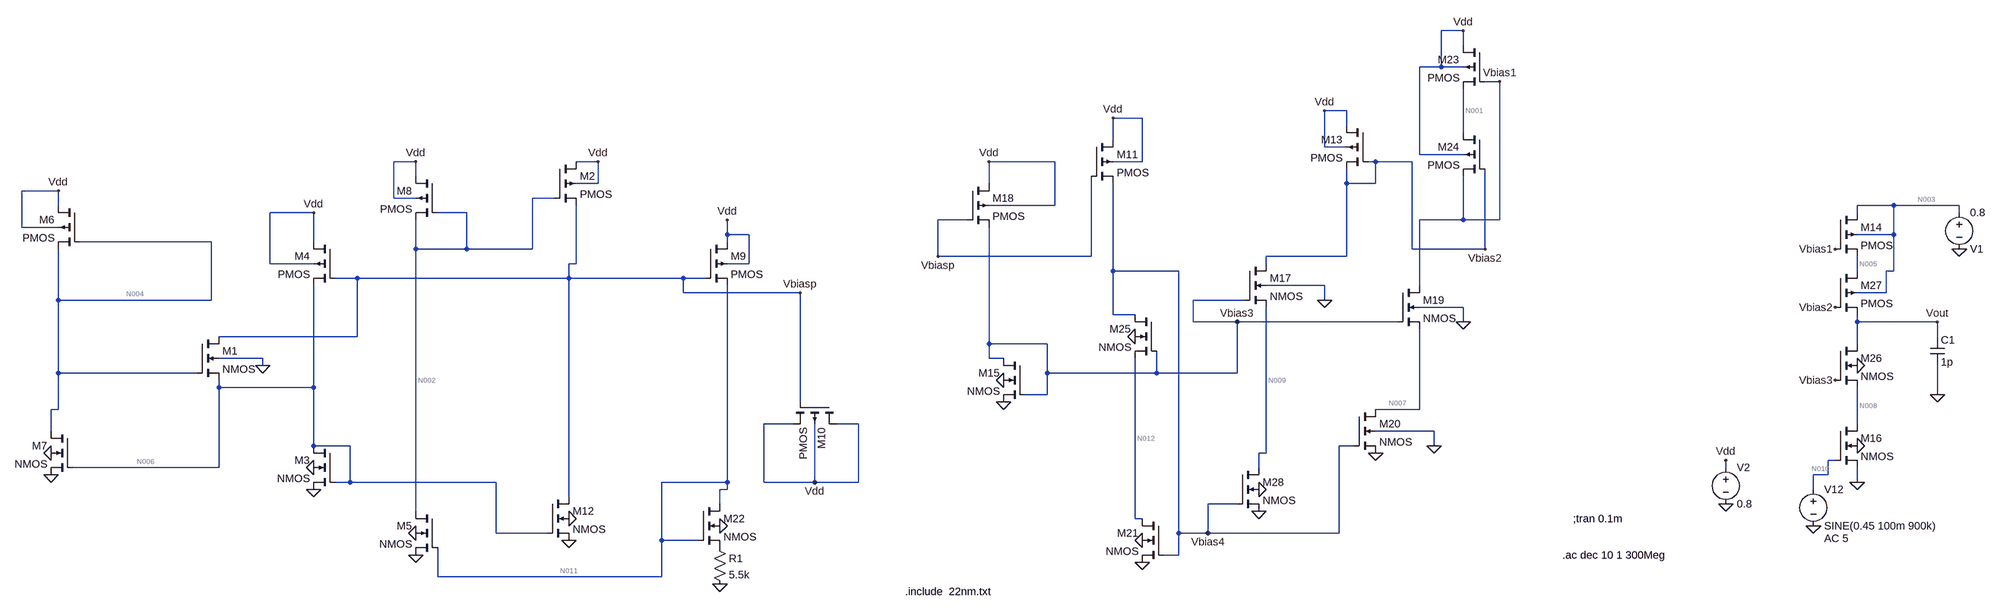
[diagram p0: schematic LTSPICE_22nm.asc]
LTSPICE_22nm.asc, the LTspice schematic file:
Version 4
SHEET 1 6952 1828
WIRE 3568 288 3520 288
WIRE 3568 320 3568 288
WIRE 3520 368 3520 288
WIRE 3520 368 3472 368
WIRE 3568 368 3520 368
WIRE 3648 400 3616 400
WIRE 3312 464 3264 464
WIRE 2864 480 2800 480
WIRE 3312 496 3312 464
WIRE 3568 512 3568 416
WIRE 2800 528 2800 480
WIRE 3264 544 3264 464
WIRE 3312 544 3264 544
WIRE 3472 560 3472 368
WIRE 3568 560 3472 560
WIRE 1104 576 1056 576
WIRE 1504 576 1456 576
WIRE 2672 576 2528 576
WIRE 2864 576 2864 480
WIRE 2864 576 2800 576
WIRE 3376 576 3360 576
WIRE 3456 576 3376 576
WIRE 1104 608 1104 576
WIRE 1504 624 1504 576
WIRE 1504 624 1456 624
WIRE 2528 624 2528 576
WIRE 3312 624 3312 592
WIRE 3376 624 3376 576
WIRE 3376 624 3312 624
WIRE 320 640 240 640
WIRE 1056 656 1056 576
WIRE 1104 656 1056 656
WIRE 1408 656 1360 656
WIRE 320 672 320 640
WIRE 2672 672 2672 576
WIRE 2672 672 2528 672
WIRE 4832 672 4752 672
WIRE 4976 672 4832 672
WIRE 880 688 784 688
WIRE 1216 688 1152 688
WIRE 4752 688 4752 672
WIRE 4976 688 4976 672
WIRE 2480 704 2416 704
WIRE 3568 704 3568 608
WIRE 3568 704 3472 704
WIRE 3648 704 3648 400
WIRE 3648 704 3568 704
WIRE 240 720 240 640
WIRE 320 720 240 720
WIRE 1872 736 1872 704
WIRE 1920 736 1872 736
WIRE 4832 736 4832 672
WIRE 4832 736 4752 736
WIRE 656 752 368 752
WIRE 880 752 880 688
WIRE 1872 752 1872 736
WIRE 1104 768 1104 704
WIRE 1216 768 1216 688
WIRE 1216 768 1104 768
WIRE 1360 768 1360 656
WIRE 1360 768 1216 768
WIRE 3456 768 3456 576
WIRE 3616 768 3616 592
WIRE 3616 768 3456 768
WIRE 2416 784 2416 704
WIRE 2752 784 2752 608
WIRE 2752 784 2416 784
WIRE 3312 784 3312 624
WIRE 3312 784 3136 784
WIRE 784 800 784 688
WIRE 880 800 784 800
WIRE 1456 800 1456 672
WIRE 1456 800 1440 800
WIRE 1920 800 1920 736
WIRE 1920 800 1872 800
WIRE 3136 800 3136 784
WIRE 2800 816 2800 624
WIRE 2944 816 2800 816
WIRE 4752 816 4752 784
WIRE 4832 816 4832 736
WIRE 4832 816 4816 816
WIRE 976 832 928 832
WIRE 1440 832 1440 800
WIRE 1440 832 976 832
WIRE 1776 832 1440 832
WIRE 1824 832 1776 832
WIRE 3264 848 3136 848
WIRE 3472 848 3472 704
WIRE 1776 864 1776 832
WIRE 2032 864 1776 864
WIRE 4816 864 4816 816
WIRE 4816 864 4752 864
WIRE 320 880 320 768
WIRE 656 880 656 752
WIRE 656 880 320 880
WIRE 3088 880 2976 880
WIRE 3264 880 3264 848
WIRE 3568 896 3472 896
WIRE 2800 912 2800 816
WIRE 2848 912 2800 912
WIRE 2976 928 2976 880
WIRE 3072 928 2976 928
WIRE 3424 928 3072 928
WIRE 3568 928 3568 896
WIRE 4752 928 4752 912
WIRE 4928 928 4752 928
WIRE 976 960 976 832
WIRE 976 960 672 960
WIRE 4928 960 4928 928
WIRE 2528 976 2528 720
WIRE 2656 976 2528 976
WIRE 4752 976 4752 928
WIRE 768 1008 672 1008
WIRE 2528 1008 2528 976
WIRE 2560 1008 2528 1008
WIRE 768 1024 768 1008
WIRE 320 1040 320 880
WIRE 624 1040 320 1040
WIRE 2656 1040 2656 976
WIRE 2896 1040 2896 992
WIRE 2896 1040 2656 1040
WIRE 3072 1040 3072 928
WIRE 3072 1040 2896 1040
WIRE 672 1072 672 1056
WIRE 880 1072 880 848
WIRE 880 1072 672 1072
WIRE 2656 1088 2656 1040
WIRE 2656 1088 2608 1088
WIRE 4928 1088 4928 1024
WIRE 2032 1104 2032 864
WIRE 320 1120 320 1040
WIRE 320 1120 304 1120
WIRE 3472 1120 3472 944
WIRE 3472 1120 3376 1120
WIRE 2016 1152 1952 1152
WIRE 2160 1152 2112 1152
WIRE 4752 1152 4752 1072
WIRE 304 1168 304 1120
WIRE 3504 1168 3376 1168
WIRE 880 1200 880 1072
WIRE 960 1200 880 1200
WIRE 3328 1200 3296 1200
WIRE 3504 1200 3504 1168
WIRE 3136 1216 3136 896
WIRE 3136 1216 3120 1216
WIRE 4704 1232 4688 1232
WIRE 672 1248 672 1072
WIRE 672 1248 352 1248
WIRE 3120 1248 3120 1216
WIRE 4464 1248 4464 1232
WIRE 4688 1264 4688 1232
WIRE 4688 1264 4656 1264
WIRE 960 1280 960 1200
WIRE 960 1280 928 1280
WIRE 1280 1280 960 1280
WIRE 1872 1280 1872 848
WIRE 1872 1280 1728 1280
WIRE 1952 1280 1952 1152
WIRE 2064 1280 2064 1152
WIRE 2064 1280 1952 1280
WIRE 2160 1280 2160 1152
WIRE 2160 1280 2064 1280
WIRE 4752 1280 4752 1248
WIRE 1872 1296 1872 1280
WIRE 1872 1296 1856 1296
WIRE 4656 1296 4656 1264
WIRE 1440 1312 1440 832
WIRE 1856 1328 1856 1296
WIRE 3072 1328 3008 1328
WIRE 1104 1344 1104 768
WIRE 2848 1360 2848 1008
WIRE 2864 1360 2848 1360
WIRE 1280 1392 1280 1280
WIRE 1392 1392 1280 1392
WIRE 2944 1392 2944 816
WIRE 3008 1392 3008 1328
WIRE 3008 1392 2944 1392
WIRE 3296 1392 3296 1200
WIRE 3296 1392 3008 1392
WIRE 1728 1408 1728 1280
WIRE 1808 1408 1728 1408
WIRE 2944 1440 2944 1392
WIRE 2944 1440 2912 1440
WIRE 1152 1488 1152 1424
WIRE 1728 1488 1728 1408
WIRE 1728 1488 1152 1488
FLAG 304 1264 0
FLAG 880 1296 0
FLAG 1104 1440 0
FLAG 1440 1408 0
FLAG 304 1216 0
FLAG 880 1248 0
FLAG 1104 1392 0
FLAG 1440 1360 0
FLAG 1856 1376 0
FLAG 1856 1504 0
FLAG 2864 1456 0
FLAG 3120 1344 0
FLAG 2864 1408 0
FLAG 3120 1296 0
FLAG 2560 1104 0
FLAG 2560 1056 0
FLAG 2848 960 0
FLAG 3264 880 0
FLAG 3376 1216 0
FLAG 4928 1088 0
FLAG 4976 768 0
FLAG 4656 1376 0
FLAG 4752 1280 0
FLAG 4928 928 Vout
FLAG 4752 1200 0
FLAG 4752 1024 0
FLAG 2032 864 Vbiasp
FLAG 2416 784 Vbiasp
FLAG 3072 928 Vbias3
FLAG 3008 1392 Vbias4
FLAG 3648 400 Vbias1
FLAG 3616 768 Vbias2
FLAG 4704 768 Vbias1
FLAG 4704 896 Vbias2
FLAG 4704 1056 Vbias3
FLAG 4464 1328 0
FLAG 4464 1232 Vdd
FLAG 320 640 Vdd
FLAG 880 688 Vdd
FLAG 1104 576 Vdd
FLAG 1504 576 Vdd
FLAG 2064 1280 Vdd
FLAG 1872 704 Vdd
FLAG 2528 576 Vdd
FLAG 2800 480 Vdd
FLAG 3264 464 Vdd
FLAG 3568 288 Vdd
FLAG 768 1024 0
FLAG 3568 928 0
FLAG 3504 1200 0
SYMBOL pmos4 368 672 M0
SYMATTR InstName M6
SYMATTR Value2 l=440n w=220n
SYMBOL pmos4 928 752 M0
SYMATTR InstName M4
SYMATTR Value2 l=44n w=528n
SYMBOL pmos4 1152 608 M0
SYMATTR InstName M8
SYMATTR Value2 l=44n w=528n
SYMBOL pmos4 1408 576 R0
SYMATTR InstName M2
SYMATTR Value2 l=44n w=528n
SYMBOL pmos4 1824 752 R0
SYMATTR InstName M9
SYMATTR Value2 l=44n w=528n
SYMBOL nmos4 624 960 R0
SYMATTR InstName M1
SYMATTR Value2 l=44n w=88n
SYMBOL nmos4 352 1168 M0
SYMATTR InstName M7
SYMATTR Value2 l=44n w=220n
SYMBOL nmos4 928 1200 M0
SYMATTR InstName M3
SYMATTR Value2 l=44n w=220n
SYMBOL nmos4 1152 1344 M0
SYMATTR InstName M5
SYMATTR Value2 l=44n w=220n
SYMBOL nmos4 1392 1312 R0
SYMATTR InstName M12
SYMATTR Value2 l=44n w=220n
SYMBOL nmos4 1808 1328 R0
SYMATTR InstName M22
SYMATTR Value2 l=44n w=660n
SYMBOL pmos4 2112 1104 R90
SYMATTR InstName M10
SYMATTR Value2 l=1100n w=1100n
SYMBOL res 1840 1408 R0
SYMATTR InstName R1
SYMATTR Value 5.5k
SYMBOL nmos4 2912 1360 M0
SYMATTR InstName M21
SYMATTR Value2 l=22n w=110n
SYMBOL nmos4 3072 1248 R0
SYMATTR InstName M28
SYMATTR Value2 l=22n w=110n
SYMBOL nmos4 2608 1008 M0
SYMATTR InstName M15
SYMATTR Value2 l=22n w=55n
SYMBOL nmos4 2896 912 M0
SYMATTR InstName M25
SYMATTR Value2 l=22n w=110n
SYMBOL nmos4 3088 800 R0
SYMATTR InstName M17
SYMATTR Value2 l=22n w=110n
SYMBOL nmos4 3328 1120 R0
SYMATTR InstName M20
SYMATTR Value2 l=22n w=110n
SYMBOL nmos4 3424 848 R0
SYMATTR InstName M19
SYMATTR Value2 l=22n w=110n
SYMBOL pmos4 2480 624 R0
SYMATTR InstName M18
SYMATTR Value2 l=22n w=264n
SYMBOL pmos4 3360 496 M0
SYMATTR InstName M13
SYMATTR Value2 l=22n w=88n
SYMBOL pmos4 2752 528 R0
SYMATTR InstName M11
SYMATTR Value2 l=22n w=264n
SYMBOL pmos4 3616 320 M0
SYMATTR InstName M23
SYMATTR Value2 l=22n w=264n
SYMBOL pmos4 3616 512 M0
SYMATTR InstName M24
SYMATTR Value2 l=22n w=264n
SYMBOL voltage 4976 672 R0
WINDOW 0 24 96 Left 2
WINDOW 3 24 16 Left 2
WINDOW 123 0 0 Left 0
WINDOW 39 0 0 Left 0
SYMATTR InstName V1
SYMATTR Value 0.8
SYMBOL voltage 4656 1280 R0
WINDOW 123 24 124 Left 2
WINDOW 39 0 0 Left 0
SYMATTR Value2 AC 5
SYMATTR InstName V12
SYMATTR Value SINE(0.45 100m 900k)
SYMBOL cap 4912 960 R0
SYMATTR InstName C1
SYMATTR Value 1p
SYMBOL nmos4 4704 1152 R0
SYMATTR InstName M16
SYMATTR Value2 l=22n w=359.39n
SYMBOL nmos4 4704 976 R0
SYMATTR InstName M26
SYMATTR Value2 l=22n w=359.39n
SYMBOL pmos4 4704 816 R0
SYMATTR InstName M27
SYMATTR Value2 l=22n w=718.79n
SYMBOL pmos4 4704 688 R0
SYMATTR InstName M14
SYMATTR Value2 l=22n w=718.79n
SYMBOL voltage 4464 1232 R0
WINDOW 123 0 0 Left 0
WINDOW 39 0 0 Left 0
SYMATTR InstName V2
SYMATTR Value 0.8
TEXT 4032 1440 Left 2 !.ac dec 10 1 300Meg
TEXT 4056 1360 Left 2 !;tran 0.1m
TEXT 2344 1520 Left 2 !.include  22nm.txt

The netlist it stands for:
* LTSPICE_22nm.asc
M6 Vdd N004 N004 Vdd PMOS l=440n w=220n
M4 Vdd Vbiasp N006 Vdd PMOS l=44n w=528n
M8 Vdd N002 N002 Vdd PMOS l=44n w=528n
M2 Vdd N002 Vbiasp Vdd PMOS l=44n w=528n
M9 Vdd Vbiasp N011 Vdd PMOS l=44n w=528n
M1 Vbiasp N004 N006 0 NMOS l=44n w=88n
M7 N004 N006 0 0 NMOS l=44n w=220n
M3 N006 N006 0 0 NMOS l=44n w=220n
M5 N002 N011 0 0 NMOS l=44n w=220n
M12 Vbiasp N006 0 0 NMOS l=44n w=220n
M22 N011 N011 P001 0 NMOS l=44n w=660n
M10 Vdd Vbiasp Vdd Vdd PMOS l=1100n w=1100n
R1 P001 0 5.5k
M21 N012 Vbias4 0 0 NMOS l=22n w=110n
M28 N009 Vbias4 0 0 NMOS l=22n w=110n
M15 Vbias3 Vbias3 0 0 NMOS l=22n w=55n
M25 Vbias4 Vbias3 N012 0 NMOS l=22n w=110n
M17 Vbias2 Vbias3 N009 0 NMOS l=22n w=110n
M20 N007 Vbias4 0 0 NMOS l=22n w=110n
M19 Vbias1 Vbias3 N007 0 NMOS l=22n w=110n
M18 Vdd Vbiasp Vbias3 Vdd PMOS l=22n w=264n
M13 Vdd Vbias2 Vbias2 Vdd PMOS l=22n w=88n
M11 Vdd Vbiasp Vbias4 Vdd PMOS l=22n w=264n
M23 Vdd Vbias1 N001 Vdd PMOS l=22n w=264n
M24 N001 Vbias2 Vbias1 Vdd PMOS l=22n w=264n
V1 N003 0 0.8
V12 N010 0 SINE(0.45 100m 900k) AC 5
C1 Vout 0 1p
M16 N008 N010 0 0 NMOS l=22n w=359.39n
M26 Vout Vbias3 N008 0 NMOS l=22n w=359.39n
M27 N005 Vbias2 Vout N003 PMOS l=22n w=718.79n
M14 N003 Vbias1 N005 N003 PMOS l=22n w=718.79n
V2 Vdd 0 0.8
.model NMOS NMOS
.model PMOS PMOS
.lib standard.mos
.ac dec 10 1 300Meg
;tran 0.1m
.include  22nm.txt
.backanno
.end

* Results of the author's LTspice run, read from the files saved beside the schematic
* Operating Point, zero values left out:
*   V(vdd) = 800 mV
*   V(n004) = 14.67 mV
*   V(vbiasp) = 248.5 mV
*   V(n006) = 539.9 mV
*   V(n002) = 265.7 mV
*   V(n011) = 538.9 mV
*   V(p001) = 52.71 mV
*   V(n012) = 103.2 mV
*   V(vbias4) = 632.7 mV
*   V(n009) = 65.09 mV
*   V(vbias3) = 604.5 mV
*   V(vbias2) = 274.5 mV
*   V(n007) = 61.79 mV
*   V(vbias1) = 243.1 mV
*   V(n001) = 706.3 mV
*   V(n003) = 800 mV
*   V(n010) = 450 mV
*   V(vout) = 661.4 mV
*   V(n008) = 189.5 mV
*   V(n005) = 760.2 mV
*   Id(M6) = 2.042 µA
*   Ig(M6) = -58.17 pA
*   Ib(M6) = 58.88 pA
*   Is(M6) = -2.042 µA
*   Id(M4) = 9.579 µA
*   Is(M4) = -9.579 µA
*   Id(M8) = 8.519 µA
*   Is(M8) = -8.519 µA
*   Id(M2) = 8.586 µA
*   Is(M2) = -8.586 µA
*   Id(M9) = 9.584 µA
*   Is(M9) = -9.584 µA
*   Ig(M10) = -10.79 pA
*   Ib(M10) = 10.68 pA
*   Id(M18) = 32.77 µA
*   Is(M18) = -32.77 µA
*   Id(M13) = 20.21 µA
*   Is(M13) = -20.21 µA
*   Id(M11) = 29.23 µA
*   Is(M11) = -29.23 µA
*   Id(M23) = 19.33 µA
*   Is(M23) = -19.33 µA
*   Id(M24) = 19.33 µA
*   Is(M24) = -19.33 µA
*   Id(M27) = 24.84 µA
*   Is(M27) = -24.84 µA
*   Id(M14) = 24.84 µA
*   Is(M14) = -24.84 µA
*   Id(M1) = 1.07 pA
*   Ig(M1) = -6.519 pA
*   Is(M1) = 6.247 pA
*   Id(M7) = 2.042 µA
*   Ig(M7) = 18.24 pA
*   Is(M7) = -2.042 µA
*   Id(M3) = 9.579 µA
*   Ig(M3) = 13.67 pA
*   Is(M3) = -9.579 µA
*   Id(M5) = 8.519 µA
*   Ig(M5) = 13.84 pA
*   Is(M5) = -8.519 µA
*   Id(M12) = 8.586 µA
*   Ig(M12) = 14.18 pA
*   Is(M12) = -8.586 µA
*   Id(M22) = 9.584 µA
*   Ig(M22) = 16.33 pA
*   Is(M22) = -9.584 µA
*   Id(M21) = 29.23 µA
*   Ig(M21) = 11.56 pA
*   Is(M21) = -29.23 µA
*   Id(M28) = 20.21 µA
*   Ig(M28) = 12.15 pA
*   Is(M28) = -20.21 µA
*   Id(M15) = 32.77 µA
*   Ig(M15) = 3.578 pA
*   Is(M15) = -32.77 µA
*   Id(M25) = 29.23 µA
*   Ig(M25) = 2.236 pA
*   Is(M25) = -29.23 µA
*   Id(M17) = 20.21 µA
*   Ig(M17) = 3.982 pA
*   Is(M17) = -20.21 µA
*   Id(M20) = 19.33 µA
*   Ig(M20) = 12.2 pA
*   Is(M20) = -19.33 µA
*   Id(M19) = 19.33 µA
*   Ig(M19) = 4.274 pA
*   Is(M19) = -19.33 µA
*   Id(M16) = 24.84 µA
*   Ig(M16) = 5.021 pA
*   Is(M16) = -24.84 µA
*   Id(M26) = 24.84 µA
*   Ig(M26) = 2.912 pA
*   Ib(M26) = -1.032 pA
*   Is(M26) = -24.84 µA
*   I(R1) = 9.584 µA
*   I(V1) = -24.84 µA
*   I(V12) = -5.021 pA
*   I(V2) = -139.9 µA
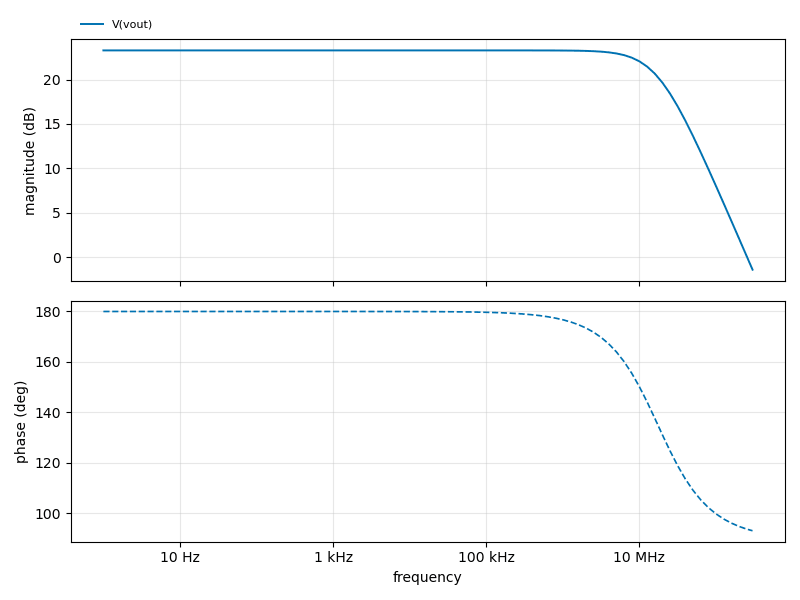
[diagram p1: AC Analysis of LTSPICE_22nm.asc, plotted from the saved traces]
* AC Analysis, 1 run:
*   V(vout): 23.29 dB at 1 Hz, -1.43 dB at 300 MHz, peak 23.29 dB at 1 Hz, 3 dB below the peak at 17.34 MHz